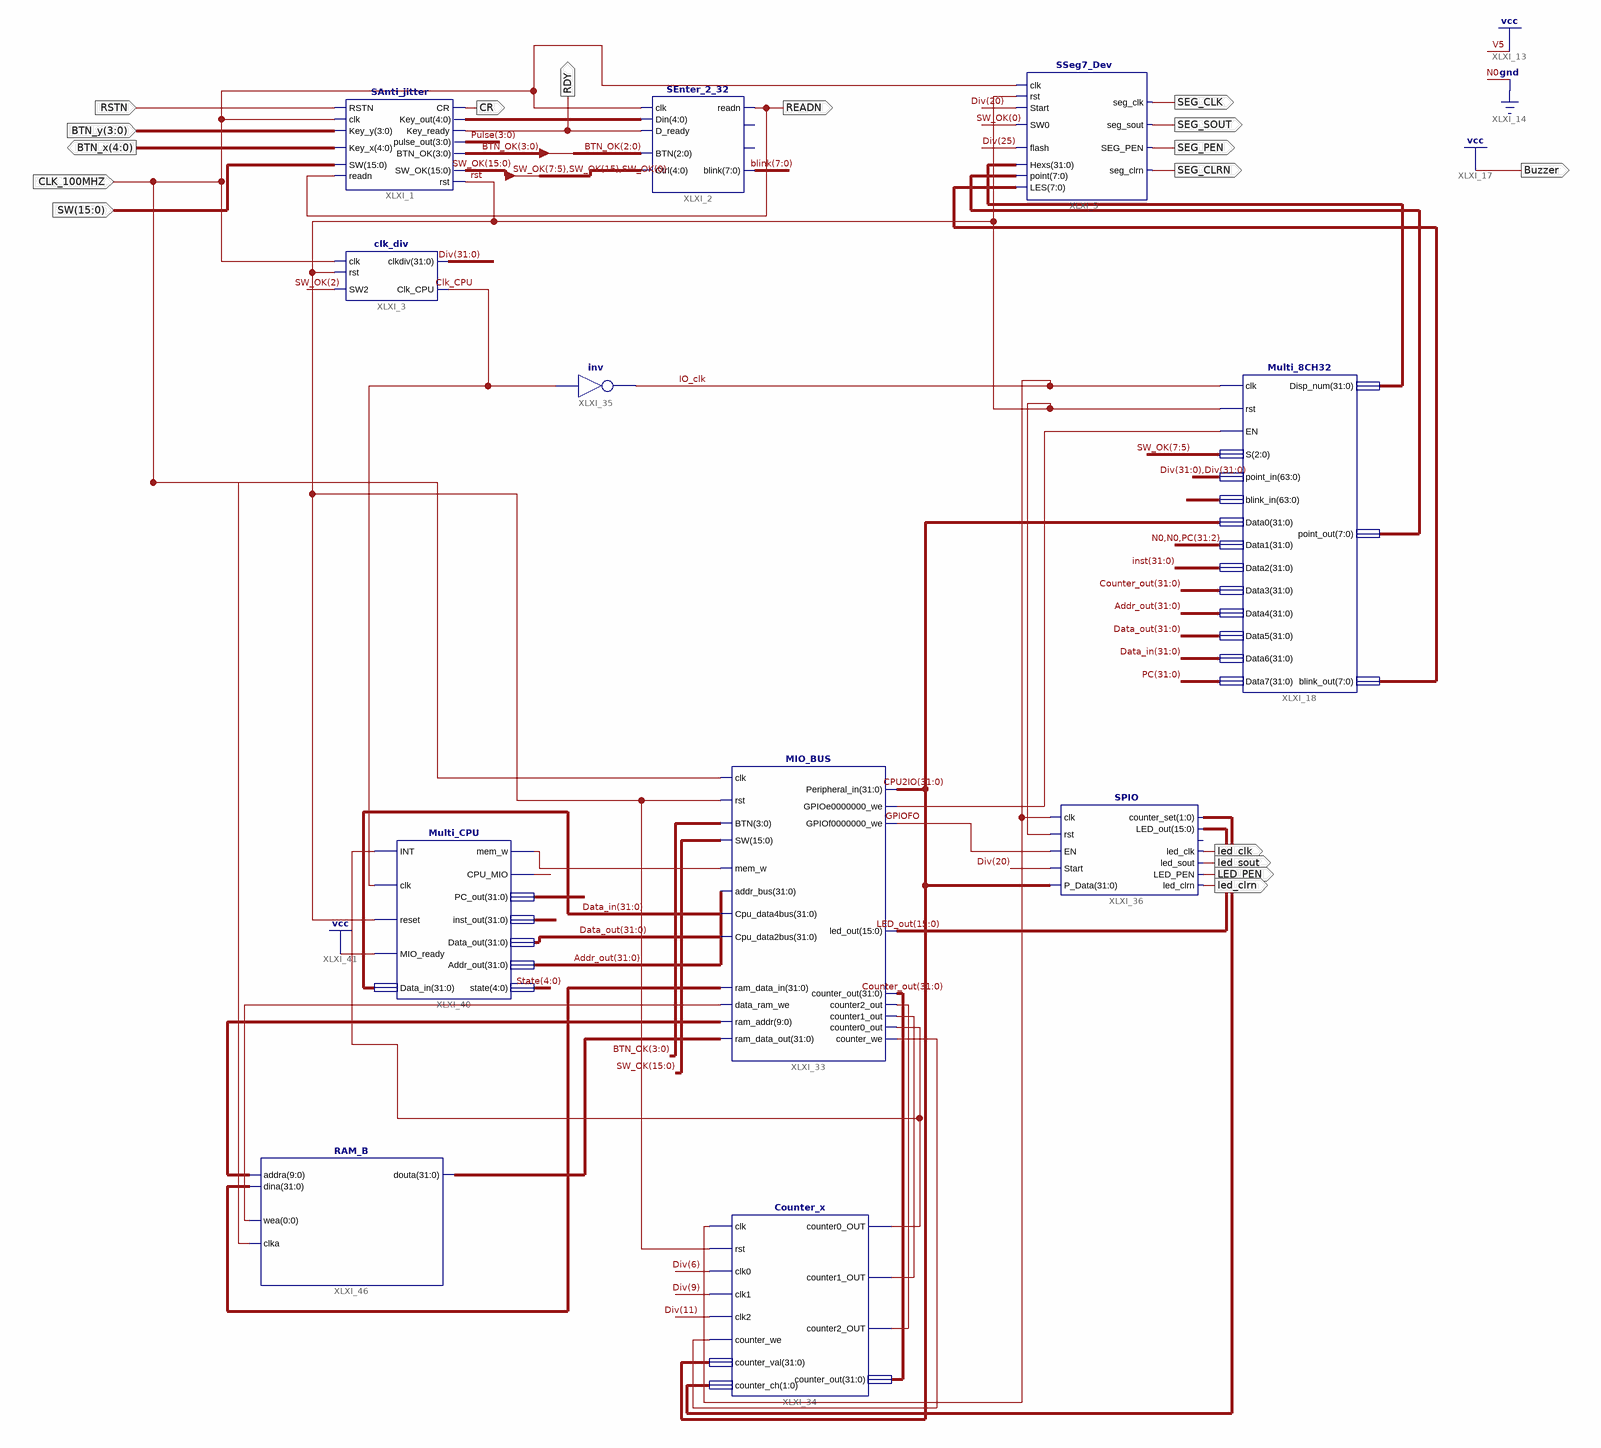
[diagram p0: schematic sheet 1]
// Xilinx ISE schematic topModule.sch (kintex7) as structural Verilog: 11 symbols, 17 ports
module topModule (
  input  RSTN,
  input  CLK_100MHZ,
  input  [3:0] BTN_y,
  input  [15:0] SW,
  output [4:0] BTN_x,
  output CR,
  output RDY,
  output SEG_CLK,
  output SEG_SOUT,
  output SEG_PEN,
  output SEG_CLRN,
  output READN,
  output led_clk,
  output led_sout,
  output LED_PEN,
  output led_clrn,
  output Buzzer
);

  wire Clk_CPU, GPIOFO, IO_clk, rst, XLXN_137, XLXN_180, XLXN_181, XLXN_183, XLXN_202, XLXN_205, XLXN_210;
  wire [0:0] XLXN_223;
  wire [1:0] XLXN_178;
  wire [3:0] BTN_OK, Pulse;
  wire [4:0] State, XLXN_10;
  wire [7:0] blink, XLXN_76, XLXN_77;
  wire [9:0] XLXN_221;
  wire [15:0] LED_out, SW_OK;
  wire [31:0] Addr_out, Counter_out, CPU2IO, Data_in, Data_out, Div, inst, PC, XLXN_74, XLXN_220, XLXN_222;

  SAnti_jitter XLXI_1 (
    .SW(SW), .readn(READN), .Key_y(BTN_y), .Key_x(BTN_x), .RSTN(RSTN), .clk(CLK_100MHZ), .Key_out(XLXN_10),
    .Key_ready(RDY), .CR(CR), .rst(rst), .SW_OK(SW_OK), .pulse_out(Pulse), .BTN_OK(BTN_OK));
  SEnter_2_32 XLXI_2 (
    .readn(READN), .blink(blink), .Din(XLXN_10), .D_ready(RDY), .clk(CLK_100MHZ),
    .Ctrl({SW_OK[7:5], SW_OK[15], SW_OK[0]}), .BTN(BTN_OK[2:0]));  // open: Ai, Bi
  clk_div XLXI_3 (.rst(rst), .clk(CLK_100MHZ), .SW2(SW_OK[2]), .clkdiv(Div), .Clk_CPU(Clk_CPU));
  SSeg7_Dev XLXI_5 (
    .LES(XLXN_77), .SEG_PEN(SEG_PEN), .seg_sout(SEG_SOUT), .seg_clrn(SEG_CLRN), .point(XLXN_76),
    .Hexs(XLXN_74), .SW0(SW_OK[0]), .flash(Div[25]), .seg_clk(SEG_CLK), .clk(CLK_100MHZ), .rst(rst),
    .Start(Div[20]));
  Multi_8CH32 XLXI_18 (
    .clk(IO_clk), .rst(rst), .EN(XLXN_202), .S(SW_OK[7:5]), .point_in({Div, Div}), .blink_in({64{1'b0}}),
    .Data0(CPU2IO), .Data1({2'b00, PC[31:2]}), .Data2(inst), .Data3(Counter_out), .Data4(Addr_out),
    .Data5(Data_out), .Data6(Data_in), .Data7(PC), .Disp_num(XLXN_74), .point_out(XLXN_76),
    .blink_out(XLXN_77));
  MIO_BUS XLXI_33 (
    .rst(rst), .clk(CLK_100MHZ), .mem_w(XLXN_137), .addr_bus(Addr_out), .Cpu_data4bus(Data_in),
    .Cpu_data2bus(Data_out), .ram_data_out(XLXN_220), .ram_addr(XLXN_221), .data_ram_we(XLXN_223[0]),
    .ram_data_in(XLXN_222), .counter_out(Counter_out), .counter2_out(XLXN_180), .counter1_out(XLXN_181),
    .counter0_out(XLXN_205), .counter_we(XLXN_183), .BTN(BTN_OK), .SW(SW_OK), .led_out(LED_out),
    .Peripheral_in(CPU2IO), .GPIOe0000000_we(XLXN_202), .GPIOf0000000_we(GPIOFO));
  Counter_x XLXI_34 (
    .clk(IO_clk), .rst(rst), .clk0(Div[6]), .clk1(Div[9]), .clk2(Div[11]), .counter_we(XLXN_183),
    .counter_val(CPU2IO), .counter_ch(XLXN_178), .counter0_OUT(XLXN_205), .counter1_OUT(XLXN_181),
    .counter2_OUT(XLXN_180), .counter_out(Counter_out));
  not XLXI_35 (IO_clk, Clk_CPU);
  SPIO XLXI_36 (
    .clk(IO_clk), .P_Data(CPU2IO), .rst(rst), .EN(GPIOFO), .Start(Div[20]), .led_clk(led_clk),
    .LED_out(LED_out), .counter_set(XLXN_178), .led_clrn(led_clrn), .LED_PEN(LED_PEN), .led_sout(led_sout));  // open: GPIOf0
  Multi_CPU XLXI_40 (
    .INT(XLXN_205), .clk(Clk_CPU), .reset(rst), .MIO_ready(1'b1), .Data_in(Data_in), .mem_w(XLXN_137),
    .CPU_MIO(XLXN_210), .PC_out(PC), .inst_out(inst), .Data_out(Data_out), .Addr_out(Addr_out), .state(State));
  RAM_B XLXI_46 (.addra(XLXN_221), .dina(XLXN_222), .wea(XLXN_223[0]), .clka(CLK_100MHZ), .douta(XLXN_220));

  assign Buzzer = 1'b1;
endmodule
